# Altium schematic sheet serial_port.SchDoc
size A4
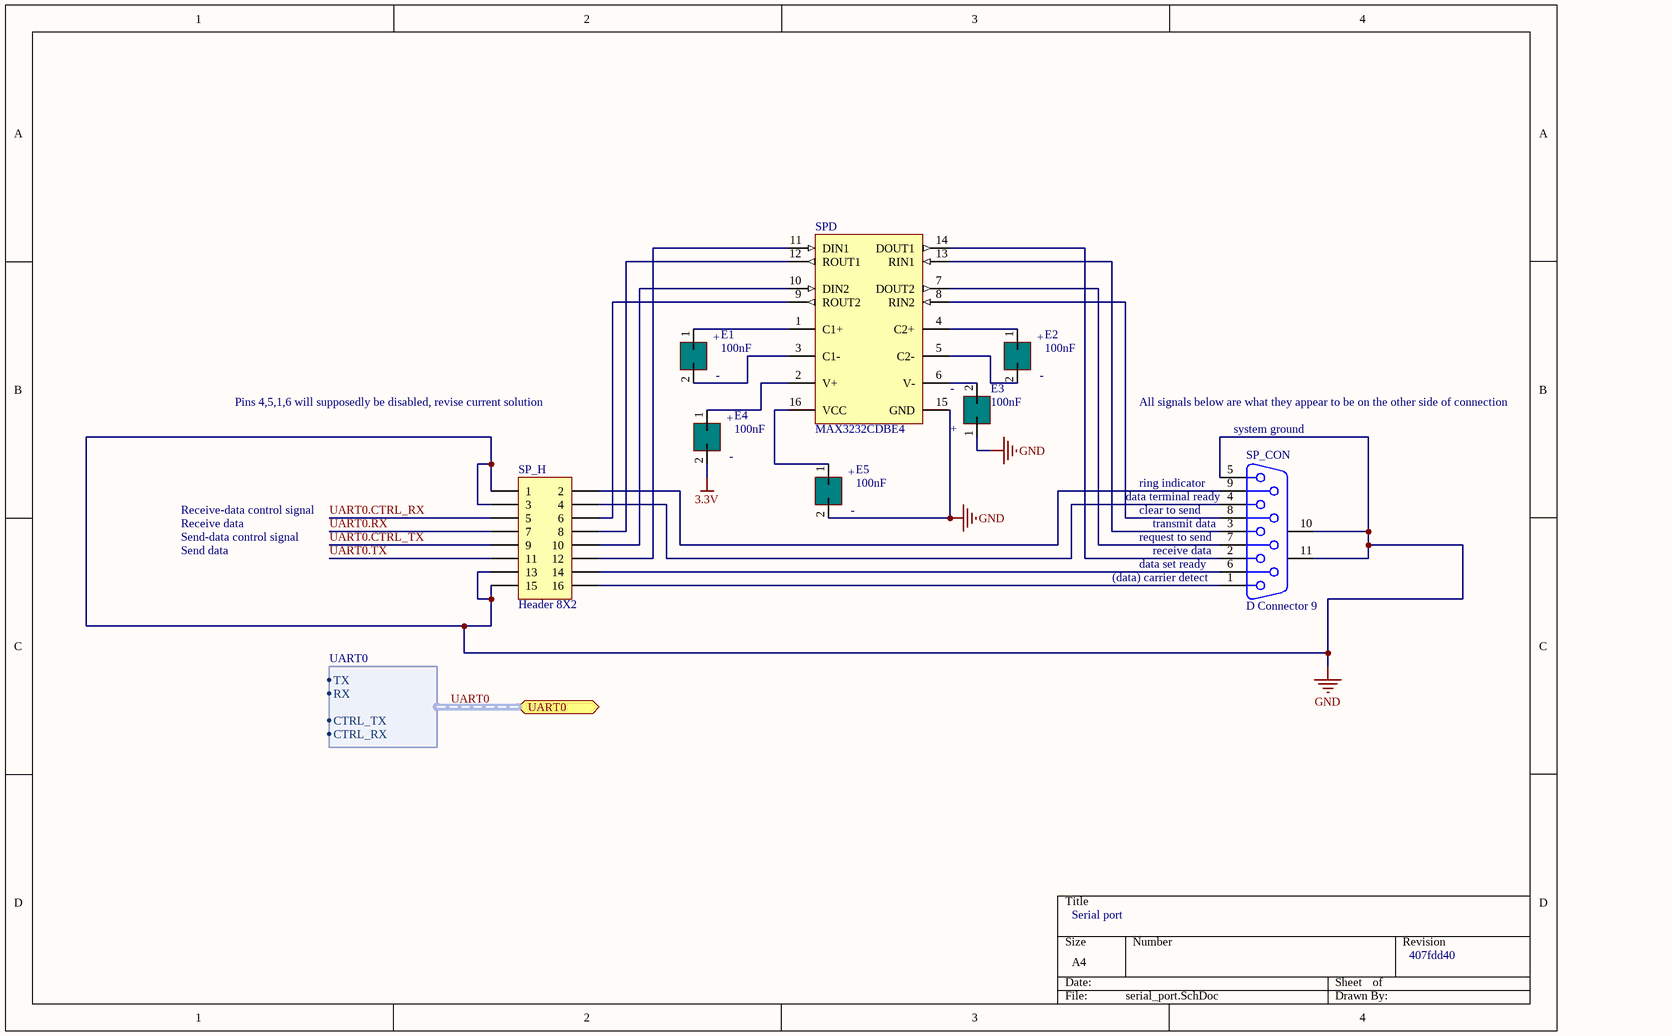
[diagram p0: serial_port.SchDoc]

## Parts
E1  100nF  [cap_pol_size_B]
E2  100nF  [cap_pol_size_B]
E3  100nF  [cap_pol_size_B]
E4  100nF  [cap_pol_size_B]
E5  100nF  [cap_pol_size_B]
SP_CON  D Connector 9  [DSUB1.385-2H9]
SP_H  Header 8X2  [HDR2X8]
SPD  MAX3232CDBE4  [TI-DB16_L]

## Ports
UART0 (harness UART0)

## Harnesses
UART0: TX, RX, CTRL_TX, CTRL_RX

## Nets
3.3V: E4.2
GND: E3.1 E5.2 SP_CON.5 SP_CON.10(MH1) SP_CON.11(MH2) SP_H.1 SP_H.3 SP_H.13 SP_H.15 SPD.15(GND)
UART0.CTRL_RX: SP_H.5
UART0.CTRL_TX: SP_H.9
UART0.RX: SP_H.7
UART0.TX: SP_H.11
NetE1_1: E1.1 SPD.1(C1+)
NetE1_2: E1.2 SPD.3(C1-)
NetE2_1: E2.1 SPD.4(C2+)
NetE2_2: E2.2 SPD.5(C2-)
NetE3_2: E3.2 SPD.6(V-)
NetE4_1: E4.1 SPD.2(V+)
NetE5_1: E5.1 SPD.16(VCC)
NetSP_CON_1: SP_CON.1 SP_H.16
NetSP_CON_2: SP_CON.2 SPD.14(DOUT1)
NetSP_CON_3: SP_CON.3 SPD.13(RIN1)
NetSP_CON_4: SP_CON.4 SP_H.4
NetSP_CON_6: SP_CON.6 SP_H.14
NetSP_CON_7: SP_CON.7 SPD.7(DOUT2)
NetSP_CON_8: SP_CON.8 SPD.8(RIN2)
NetSP_CON_9: SP_CON.9 SP_H.2
NetSP_H_6: SP_H.6 SPD.9(ROUT2)
NetSP_H_8: SP_H.8 SPD.12(ROUT1)
NetSP_H_10: SP_H.10 SPD.10(DIN2)
NetSP_H_12: SP_H.12 SPD.11(DIN1)

## Buses and harness runs
harness UART0 = port UART0

## Notes on the sheet
- Pins 4,5,1,6 will supposedly be disabled, revise current solution
- All signals below are what they appear to be on the other side of connection
- (near SP_CON) system ground
- Receive-data control signal
- (near SP_CON) data terminal ready
- (near SP_CON) clear to send
- (near SP_CON) ring indicator
- Send data
- Send-data control signal
- Receive data
- (near SP_CON) (data) carrier detect
- (near SP_CON) request to send
- (near SP_CON) data set ready
- (near SP_CON) transmit data
- (near SP_CON) receive data
- Serial port
- 407fdd40
- (in symbol CAP_POL_SIZE_B) +; -

## Library data of the parts
E1-E5 = CAP_POL_SIZE_B: size B series S type V capacitor, panasonic elec
SP_CON = D Connector 9: Receptacle Assembly, 9 Position, Right Angle; PackageDocument: O; Positions: 9; Published: 15-Jun-2001; LatestRevisionDate: 17-Jul-2002; LatestRevisionNote: Re-released for DXP Platform.; DatasheetDocument: 1-Sep-1999; PackageReference: 788750; Publisher: Altium Limited; Orientation: Right Angle; Gender: Receptacle
SP_H = Header 8X2: Header, 8-Pin, Dual row; LatestRevisionDate: 17-Jul-2002; LatestRevisionNote: Re-released for DXP Platform.; Publisher: Altium Limited
SPD = CMP-0299-01177-1: 3-V to 5.5-V Multichannel RS-232 Line Driver / Receiver with ±15-kV ESD Protection, 0 to 70 degC, 16-Pin SSOP (DB), Green (RoHS & no Sb/Br); RS-232: TRUE; Supply Voltage(s)(V): 3.3 or 5.0; ESD HBM(kV): +/-15; ICC(Max)(mA): 1; Drivers Per Package: 2; SubFamily: RS-232; ComponentLink1URL: www.ti.com; ComponentLink3Description: Package Specification; PackageDescription: 16-Pin Plastic Small Outline Package, 6.2 x 5.3 mm Body, 0.65 mm Pitch; ComponentLink2URL: http://www.ti.com/general/docs/lit/getliterature.tsp?genericPartNumber=MAX3232&fileType=pdf; Single Supply: TRUE; ComponentLink3URL: http://www.ti.com/litv/pdf/msso002e; PackageVersion: revE, Dec-2001; ComponentLink1Description: Manufacturer URL; ComponentLink2Description: Datasheet; Receivers Per Package: 2; DatasheetVersion: SLLS410I; PackageReference: DB16